# Altium schematic sheet TopLevel.SchDoc: Treetap 7C - Top Level Schematic
size A3; Author: Treetap Group; DrawnBy: Treetap Group; Revision: 1; SheetNumber: 1; SheetTotal: 7
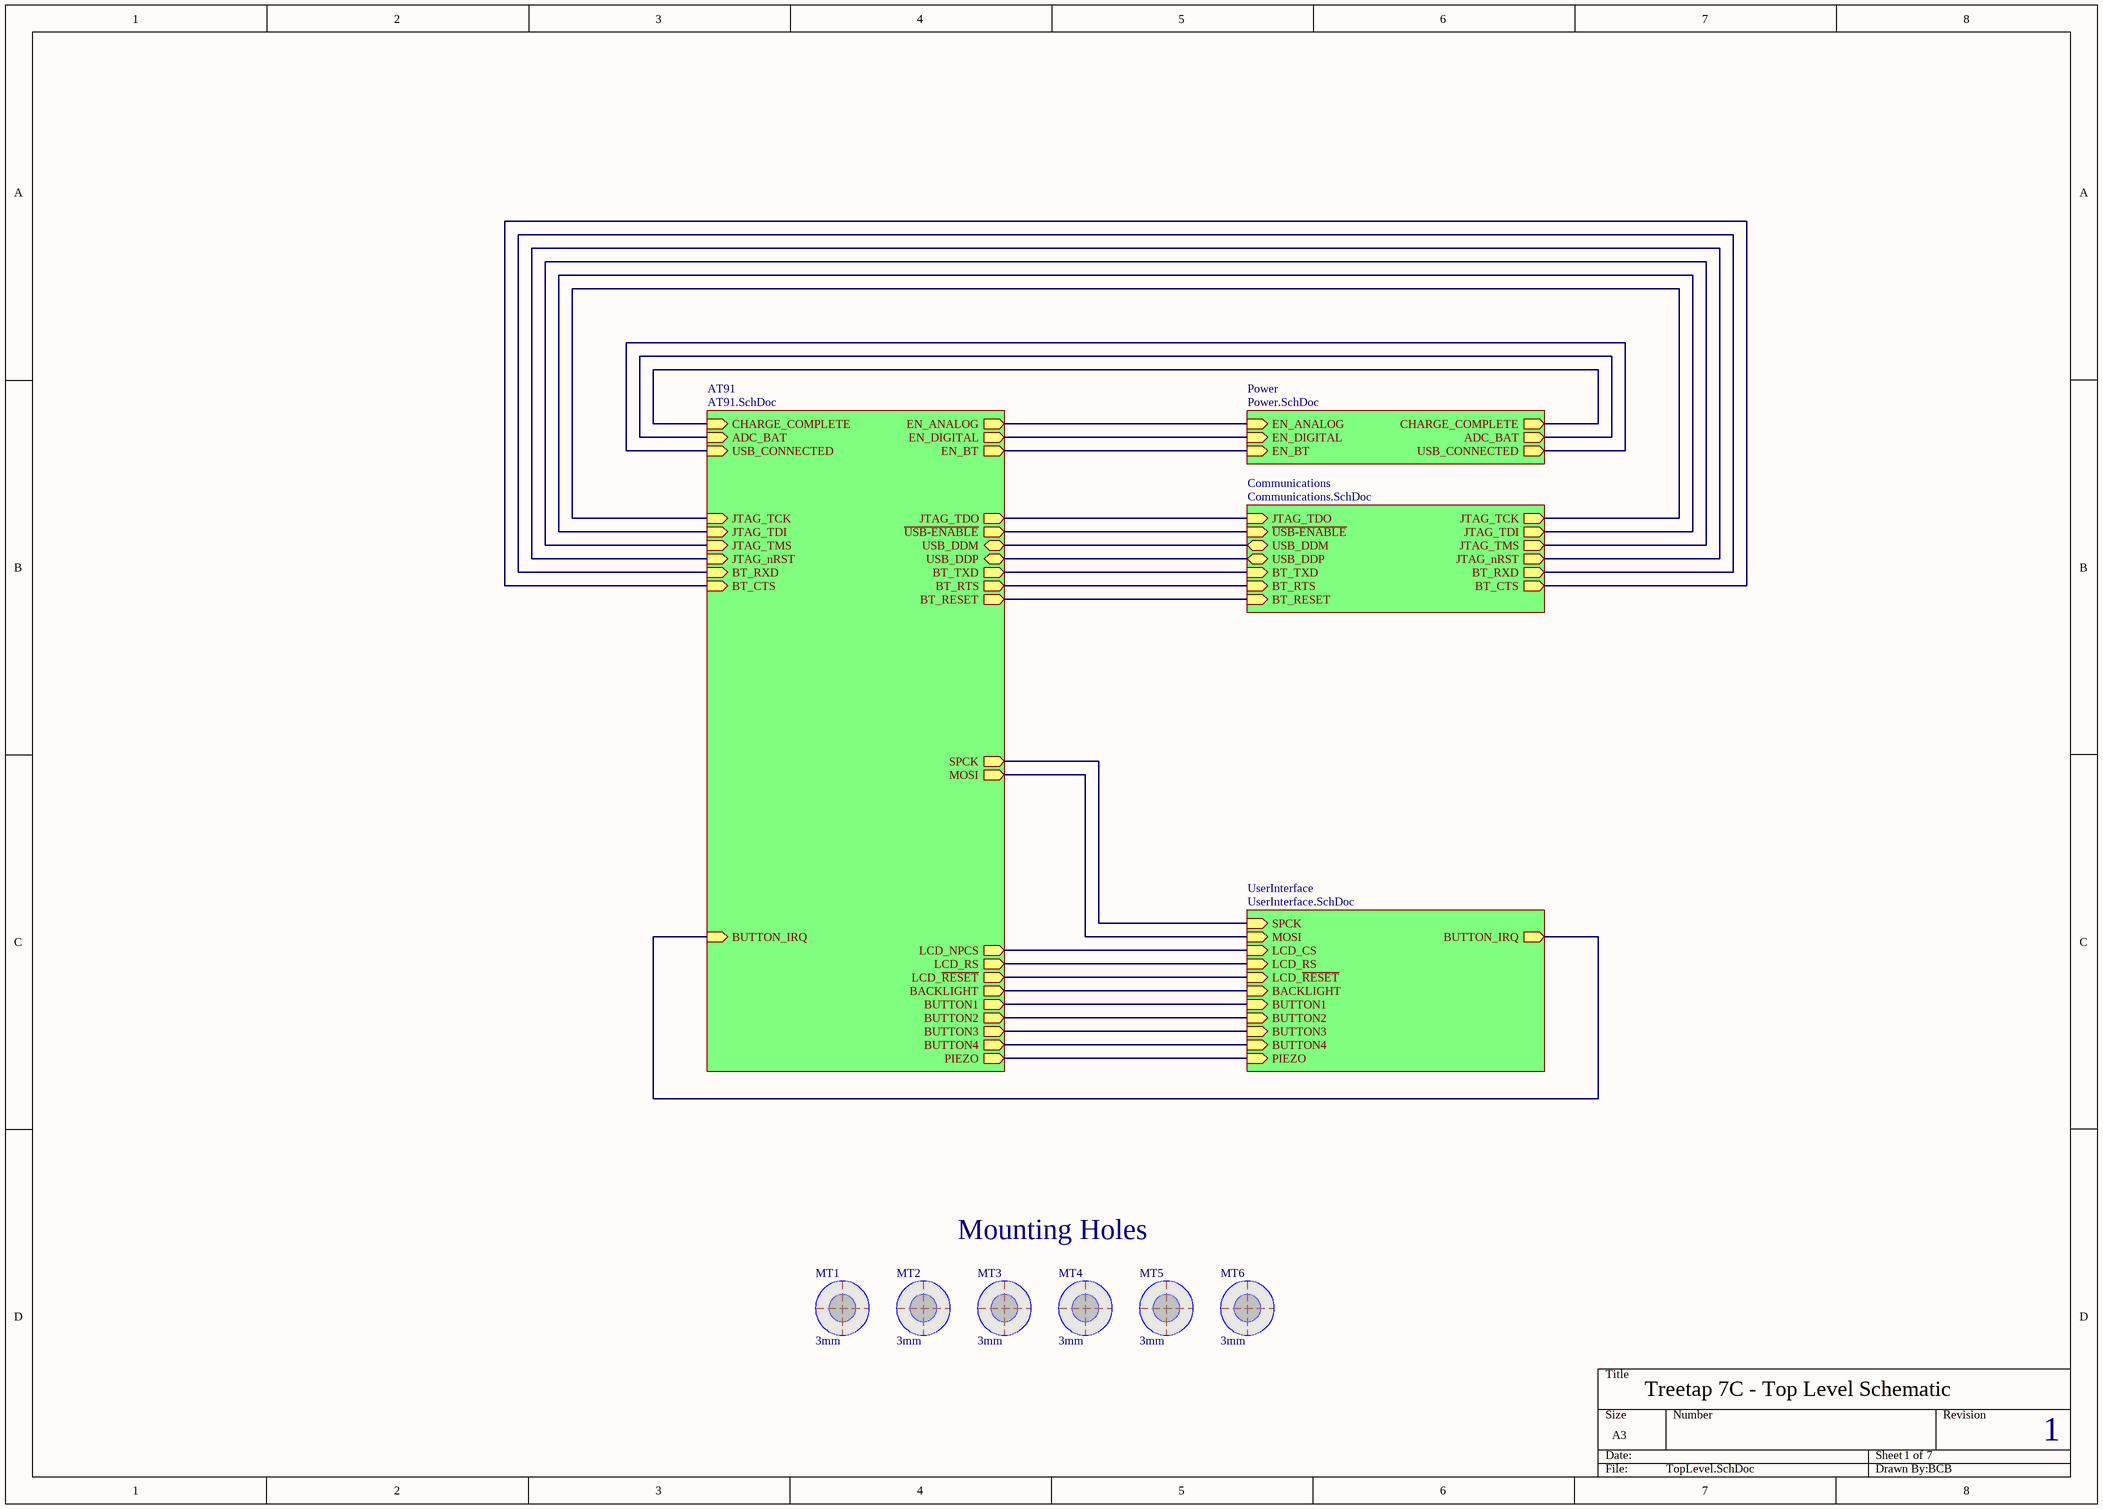
[diagram p0: TopLevel.SchDoc]

## Parts
MT1  3mm  [MNT-HOLE_3mmNPTH]  (no BOM)
MT2  3mm  [MNT-HOLE_3mmNPTH]  (no BOM)
MT3  3mm  [MNT-HOLE_3mmNPTH]  (no BOM)
MT4  3mm  [MNT-HOLE_3mmNPTH]  (no BOM)
MT5  3mm  [MNT-HOLE_3mmNPTH]  (no BOM)
MT6  3mm  [MNT-HOLE_3mmNPTH]  (no BOM)

## Sub-sheets
AT91 = AT91.SchDoc: MOSI (out), SPCK (out), ADC_BAT (in), BUTTON_IRQ (in), BUTTON1 (out), BUTTON2 (out), BT_RESET (out), PIEZO (out), BUTTON3 (out), CHARGE_COMPLETE (in), LCD_NPCS (out), LCD_RS (out), BT_RXD (in), BT_TXD (out), BT_CTS (in), JTAG_TMS (in), JTAG_TCK (in), JTAG_TDO (out), JTAG_TDI (in), JTAG_nRST (in), EN_DIGITAL (out), EN_ANALOG (out), BT_RTS (out), USB_DDM (bidir), USB_DDP (bidir), EN_BT (out), LCD_~{RESET} (out), BACKLIGHT (out), USB_CONNECTED (in), BUTTON4 (out), ~{USB-ENABLE} (out)
Communications = Communications.SchDoc: JTAG_TCK (out), JTAG_TDI (out), JTAG_TDO (in), JTAG_TMS (out), JTAG_nRST (out), USB_DDM (bidir), USB_DDP (bidir), BT_RXD (out), BT_TXD (in), BT_CTS (out), BT_RTS (in), BT_RESET (in), ~{USB-ENABLE} (in)
Power = Power.SchDoc: EN_ANALOG (in), EN_DIGITAL (in), EN_BT (in), CHARGE_COMPLETE (out), ADC_BAT (out), USB_CONNECTED (out)
UserInterface = UserInterface.SchDoc: LCD_RS (in), SPCK (in), MOSI (in), PIEZO (in), BUTTON1 (in), BUTTON2 (in), BUTTON_IRQ (out), BUTTON3 (in), LCD_CS (in), BACKLIGHT (in), LCD_~{RESET} (in), BUTTON4 (in)

## Nets
(unnamed): sheet AT91/MOSI, sheet UserInterface/MOSI
(unnamed): sheet AT91/SPCK, sheet UserInterface/SPCK
(unnamed): sheet AT91/ADC_BAT, sheet Power/ADC_BAT
(unnamed): sheet AT91/BUTTON_IRQ, sheet UserInterface/BUTTON_IRQ
(unnamed): sheet AT91/BUTTON1, sheet UserInterface/BUTTON1
(unnamed): sheet AT91/BUTTON2, sheet UserInterface/BUTTON2
(unnamed): sheet AT91/BT_RESET, sheet Communications/BT_RESET
(unnamed): sheet AT91/PIEZO, sheet UserInterface/PIEZO
(unnamed): sheet AT91/BUTTON3, sheet UserInterface/BUTTON3
(unnamed): sheet AT91/CHARGE_COMPLETE, sheet Power/CHARGE_COMPLETE
(unnamed): sheet AT91/LCD_NPCS, sheet UserInterface/LCD_CS
(unnamed): sheet AT91/LCD_RS, sheet UserInterface/LCD_RS
(unnamed): sheet AT91/BT_RXD, sheet Communications/BT_RXD
(unnamed): sheet AT91/BT_TXD, sheet Communications/BT_TXD
(unnamed): sheet AT91/BT_CTS, sheet Communications/BT_CTS
(unnamed): sheet AT91/JTAG_TMS, sheet Communications/JTAG_TMS
(unnamed): sheet AT91/JTAG_TCK, sheet Communications/JTAG_TCK
(unnamed): sheet AT91/JTAG_TDO, sheet Communications/JTAG_TDO
(unnamed): sheet AT91/JTAG_TDI, sheet Communications/JTAG_TDI
(unnamed): sheet AT91/JTAG_nRST, sheet Communications/JTAG_nRST
(unnamed): sheet AT91/EN_DIGITAL, sheet Power/EN_DIGITAL
(unnamed): sheet AT91/EN_ANALOG, sheet Power/EN_ANALOG
(unnamed): sheet AT91/BT_RTS, sheet Communications/BT_RTS
(unnamed): sheet AT91/USB_DDM, sheet Communications/USB_DDM
(unnamed): sheet AT91/USB_DDP, sheet Communications/USB_DDP
(unnamed): sheet AT91/EN_BT, sheet Power/EN_BT
(unnamed): sheet AT91/LCD_~{RESET}, sheet UserInterface/LCD_~{RESET}
(unnamed): sheet AT91/BACKLIGHT, sheet UserInterface/BACKLIGHT
(unnamed): sheet AT91/USB_CONNECTED, sheet Power/USB_CONNECTED
(unnamed): sheet AT91/BUTTON4, sheet UserInterface/BUTTON4
(unnamed): sheet AT91/~{USB-ENABLE}, sheet Communications/~{USB-ENABLE}

## Notes on the sheet
- Mounting Holes
- Treetap 7C - Top Level Schematic
- 1
- 7
- BCB

## Library data of the parts
MT1-MT6 = MNT-HOLE_3mmNPTH: 3mm Mount hole NPTH; ECE_Component_Code: MNT-HOLE_3.2mmNPTH; Supplier_Component_Code: -; published: 12/03/2007 11:34:37 a.m.; Supplier_Name: -; price: 0; value: 3mm